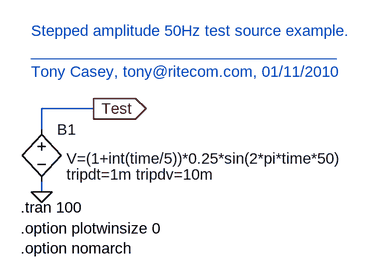
[diagram p0: schematic Stepped_50Hz_Test.asc]
Stepped_50Hz_Test.asc, the LTspice schematic file:
Version 4
SHEET 1 880 680
WIRE 208 112 128 112
WIRE 128 144 128 112
WIRE 128 240 128 224
FLAG 128 240 0
FLAG 208 112 Test
IOPIN 208 112 Out
SYMBOL bv 128 128 R0
WINDOW 3 39 61 Left 0
WINDOW 39 39 85 Left 0
SYMATTR Value V=(1+int(time/5))*0.25*sin(2*pi*time*50)
SYMATTR SpiceLine tripdt=1m tripdv=10m
SYMATTR InstName B1
TEXT 96 264 Left 0 !.tran 100
TEXT 96 296 Left 0 !.option plotwinsize 0\n.option nomarch
TEXT 112 -8 Left 0 ;Stepped amplitude 50Hz test source example.\n____________________________________\nTony Casey, tony@ritecom.com, 01/11/2010

The netlist it stands for:
* Stepped_50Hz_Test.asc
B1 Test 0 V=(1+int(time/5))*0.25*sin(2*pi*time*50) tripdt=1m tripdv=10m
.tran 100
.option plotwinsize 0
.option nomarch
* Stepped amplitude 50Hz test source example.
* ____________________________________
* Tony Casey, tony@ritecom.com, 01/11/2010
.backanno
.end